# Altium schematic sheet camera.SchDoc
size A4
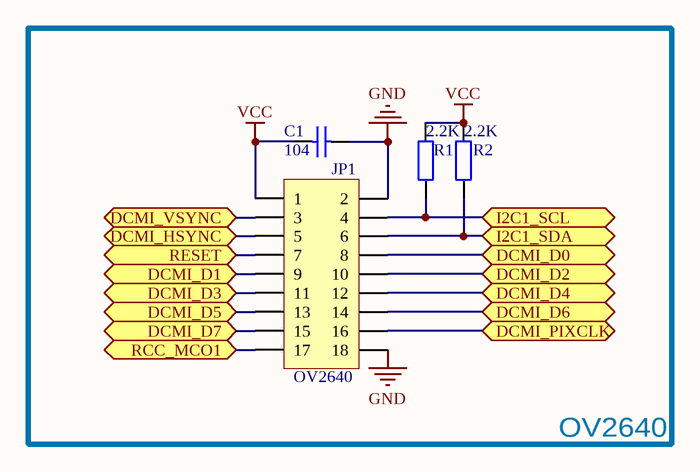
[diagram p0: camera.SchDoc]

## Parts
C1  104  [C 0603_L]
JP1  OV2640  [HDR2.54-LI-2x9P]
R1  2.2K  [R 0603_L]
R2  2.2K  [R 0603_L]

## Blocks framed on the sheet
OV2640: C1 JP1 R1 R2

## Ports
DCMI_D0 (bidir), DCMI_D1 (bidir), DCMI_D2 (bidir), DCMI_D3 (bidir), DCMI_D4 (bidir), DCMI_D5 (bidir), DCMI_D6 (bidir), DCMI_D7 (bidir), DCMI_HSYNC (bidir), DCMI_PIXCLK (bidir), DCMI_VSYNC (bidir), I2C1_SCL (bidir), I2C1_SDA (bidir), RCC_MCO1 (bidir), RESET (bidir)

## Nets
GND: C1.1 JP1.2 JP1.18
VCC: C1.2 JP1.1 R1.2 R2.2
DCMI_D0: JP1.8 ; port DCMI_D0
DCMI_D1: JP1.9 ; port DCMI_D1
DCMI_D2: JP1.10 ; port DCMI_D2
DCMI_D3: JP1.11 ; port DCMI_D3
DCMI_D4: JP1.12 ; port DCMI_D4
DCMI_D5: JP1.13 ; port DCMI_D5
DCMI_D6: JP1.14 ; port DCMI_D6
DCMI_D7: JP1.15 ; port DCMI_D7
DCMI_HSYNC: JP1.5 ; port DCMI_HSYNC
DCMI_PIXCLK: JP1.16 ; port DCMI_PIXCLK
DCMI_VSYNC: JP1.3 ; port DCMI_VSYNC
I2C1_SCL: JP1.4 R1.1 ; port I2C1_SCL
I2C1_SDA: JP1.6 R2.1 ; port I2C1_SDA
RCC_MCO1: JP1.17 ; port RCC_MCO1
RESET: JP1.7 ; port RESET

## Library data of the parts
C1 = Cap: Capacitor; Published: 8-Jun-2000; LatestRevisionDate: 17-Jul-2002; LatestRevisionNote: Re-released for DXP Platform.; PackageReference: RAD-0.3; Publisher: Altium Limited; PackageDescription: Radial Cap, Thru-Hole; 2 Leads; 0.3 in Pin Spacing; Value: 104
JP1 = Header 9X2: 9*2P接插件; 版权归属: 源创客; BOM名称: 9*2P接插件; 学习资源: www.ooocke.com
R1 R2 = Res2: Resistor; Published: 8-Jun-2000; LatestRevisionDate: 17-Jul-2002; LatestRevisionNote: Re-released for DXP Platform.; PackageReference: AXIAL-0.4; Publisher: Altium Limited; PackageDescription: Axial Device, Thru-Hole; 2 Leads; 0.4 in Pin Spacing; Value: 2.2K